# EAGLE design control_board-M0_breakout (EAGLE 8.3.1)
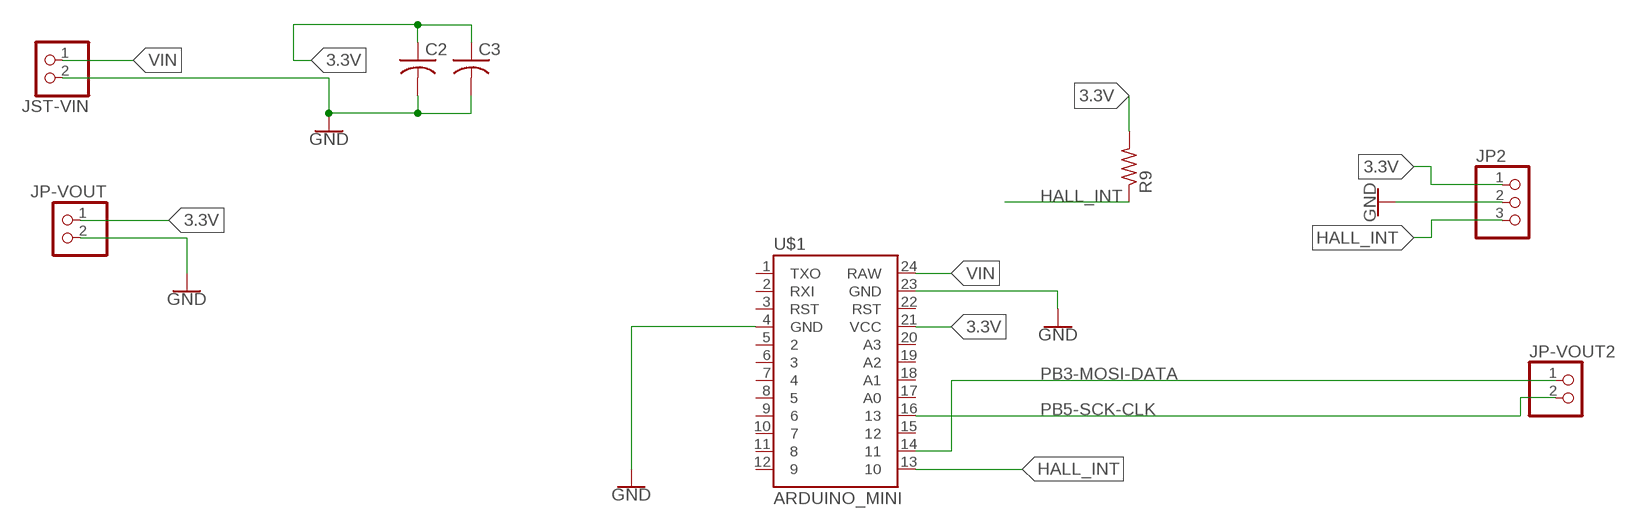
[diagram p0: schematic, sheet 1]

## Parts
C2  C-US025-060X050  [C025-060X050]
C3  C-US025-060X050  [C025-060X050]
JP2  PINHD-1X3  [1X03]
JP-VOUT  PINHD-1X2  [1X02]
JP-VOUT2  PINHD-1X2  [1X02]
JST-VIN  JST_2PIN-THM-RA  [JST-PH-2-THM-RA]
R9  R-US_0207/7  [0207/7]
U$1  ARDUINO_MINI  [ARDUINO_MINI]

## Nets
3.3V: C2.1 C3.1 JP2.1 JP-VOUT.1 R9.2 U$1.21(VCC)
GND: C2.2 C3.2 JP2.2 JP-VOUT.2 JST-VIN.2 U$1.4(GND) U$1.23(GND)
HALL_INT: JP2.3 R9.1 U$1.13
PB3-MOSI-DATA: JP-VOUT2.1 U$1.14
PB5-SCK-CLK: JP-VOUT2.2 U$1.16
VIN: JST-VIN.1 U$1.24(RAW)
Unconnected: U$1.1(TXO) U$1.2(RXI) U$1.3(RST) U$1.5 U$1.6 U$1.7 U$1.8 U$1.9 U$1.10 U$1.11 U$1.12 U$1.15 U$1.17(A0) U$1.18(A1) U$1.19(A2) U$1.20(A3) U$1.22(RST)

## Library data of the parts
C2 C3 = adafruit:C-US: CAPACITOR, American symbol
JP2 = pinhead:PINHD-1X3: PIN HEADER
JP-VOUT JP-VOUT2 = pinhead:PINHD-1X2: PIN HEADER
JST-VIN = adafruit:JST_2PIN: JST 2-Pin Connectors of various flavors SMT-RA (S2B-PH-SM4) 4UConnector #17311 SMT (B2B-PH-SM4) THM-RA (S2B-PH) THM (B2B-PH)
R9 = adafruit:R-US_: RESISTOR, American symbol
U$1 = SparkFun-Retired:ARDUINO_MINI: Arduino Pro Mini footprint

## Board
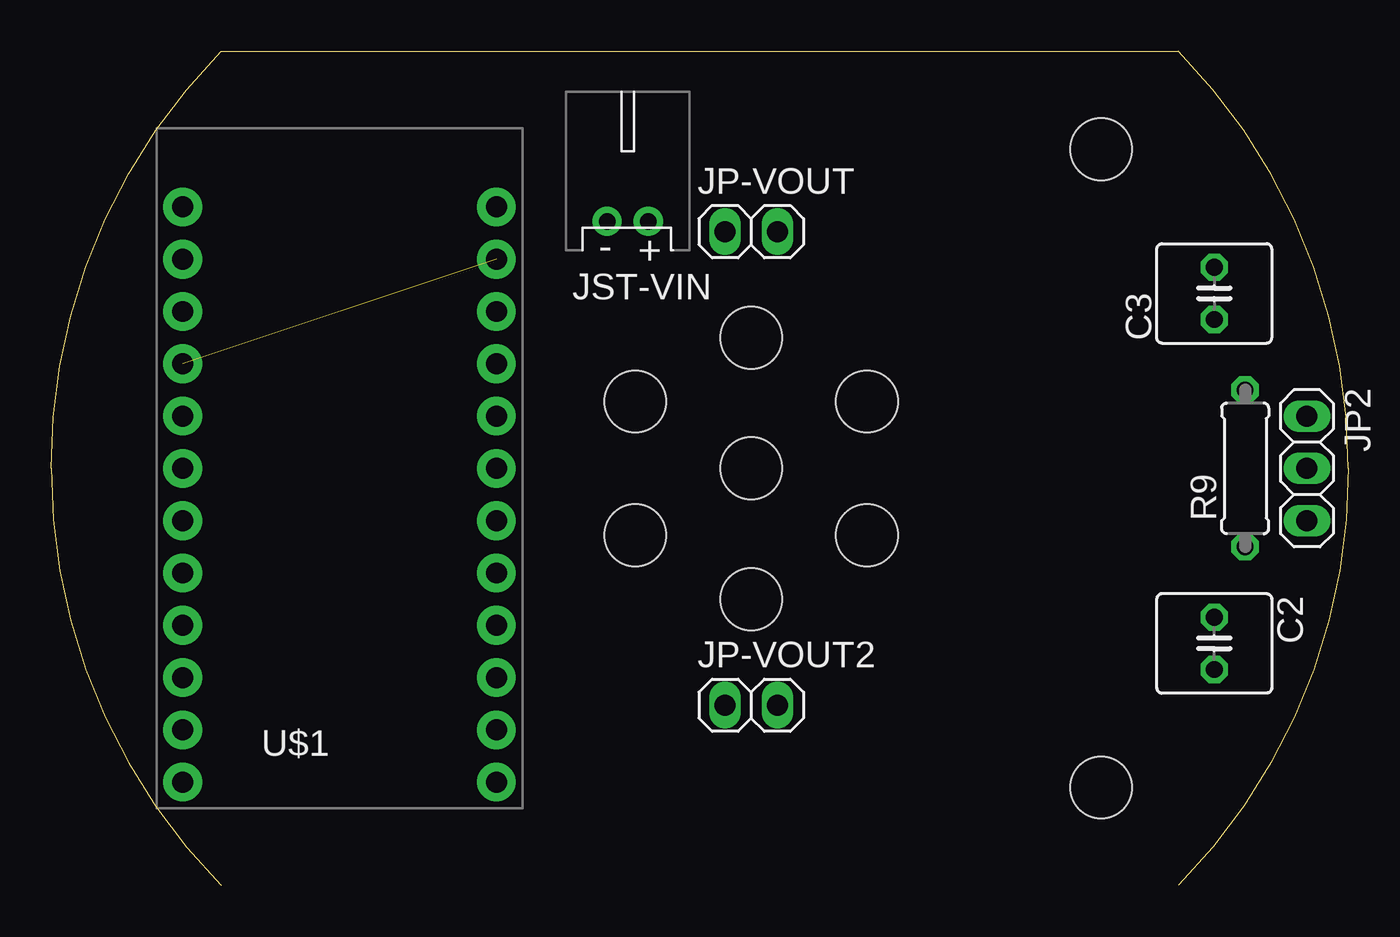
[diagram p1: board, top side]
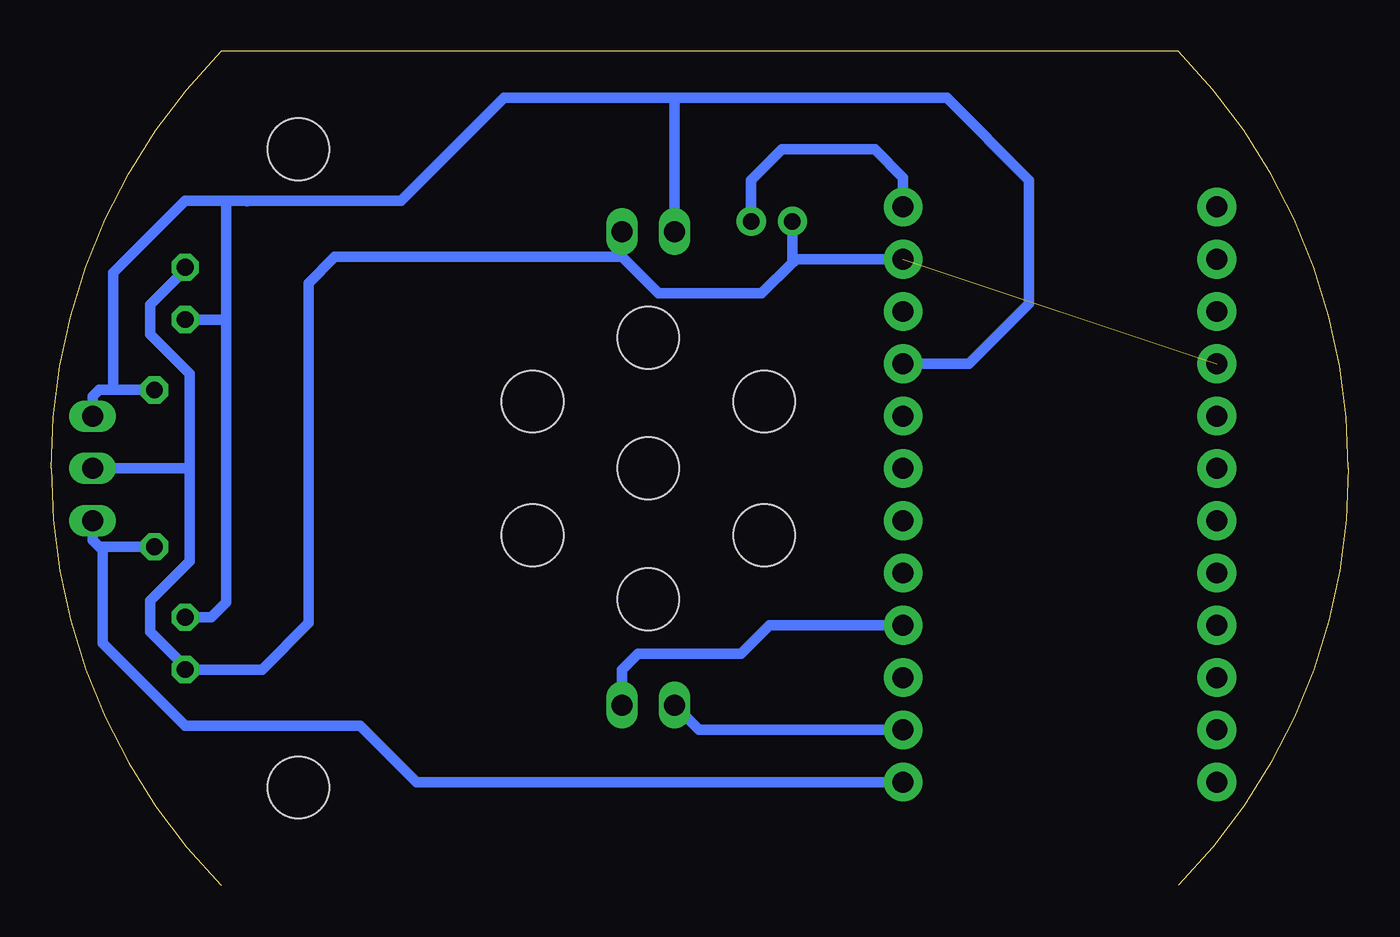
[diagram p2: board, bottom side, seen from below]

Size 63 x 40.5 mm. Coordinates in mm from the lower left corner, seen from the top.
Outline: 8.25,0 arc-45 0,20.25 arc-45 8.25,40.5 54.75,40.5 arc-45 63,20.25 arc-45 54.75,0
Copper layers (1*16): Top 0.035mm / dielectric 1.5mm / Bottom 0.035mm
Design rules "OthermillDRC_1_32_v2": minimum track width 8mil, minimum drill 0.8mm, track to track 0.794003125mm, track to pad 0.794003125mm, pad to pad 0.794003125mm, via to via 0.794003125mm, smd to smd 0mil, copper to edge 0mil, drill to drill 1mil, minimum pad ring 10mil, minimum via ring 10mil, stop-mask expansion 1mil, vias tented up to drill 30mil, thermal gap 10mil
Holes 3 mm at 34,20.25 34,26.6 39.63,17 28.37,17 51,35.75 51,4.75 34,20.25 34,13.9 28.37,23.5 39.63,23.5

### Footprints (pad centres in the part's own frame; a part is rotated, then mirrored left to right if it is on the bottom)
C025-060X050 = drill 0.813 octagon: 1 -1.27,0; 2 1.27,0
1X03 = drill 1.016 long: 1 -2.54,0; 2 0,0; 3 2.54,0
1X02 = drill 1.016 long: 1 -1.27,0; 2 1.27,0
JST-PH-2-THM-RA = drill 0.8 pad 1.422: 1 1,0; 2 -1,0
0207/7 = drill 0.813 octagon: 1 -3.81,0; 2 3.81,0
ARDUINO_MINI = drill 1.016 pad 1.88: 1 -7.62,12.7; 2 -7.62,10.16; 3 -7.62,7.62; 4 -7.62,5.08; 5 -7.62,2.54; 6 -7.62,0; 7 -7.62,-2.54; 8 -7.62,-5.08; 9 -7.62,-7.62; 10 -7.62,-10.16; 11 -7.62,-12.7; 12 -7.62,-15.24; 13 7.62,-15.24; 14 7.62,-12.7; 15 7.62,-10.16; 16 7.62,-7.62; 17 7.62,-5.08; 18 7.62,-2.54; 19 7.62,0; 20 7.62,2.54; 21 7.62,5.08; 22 7.62,7.62; 23 7.62,10.16; 24 7.62,12.7

### Placement (x,y rotation side)
C2  56.5,11.75 270 top
C3  56.5,28.75 90 top
JP2  61,20.25 270 top
JP-VOUT  34,31.75 0 top
JP-VOUT2  34,8.75 0 top
JST-VIN  28,32.25 0 top
R9  58,20.25 90 top
U$1  14,20.25 0 top

### Tracks (layer width: path | path; a pad name or v marks a point on that pad's centre or on a via)
3.3V
  Bottom 0.508: 60.05,24.06 60.69,24.06 61,23.75 JP2.1 | R9.2 60.05,24.06 | 54.56,33.25 53.46,33.25 | 54.56,33.25 56.5,33.25 60,29.75 60,24.11 60.05,24.06 | 53.48,33.23 53.46,33.25 | 53.46,33.25 46,33.25 41,38.25 32.72,38.25 | 32.72,38.25 19.5,38.25 15.5,34.25 15.5,28.25 18.42,25.33 U$1.21 | JP-VOUT.1 32.73,38.24 32.72,38.25 | C2.1 55.23,13.02 54.5,13.75 54.5,27.3 | 54.5,27.3 54.5,33.19 54.56,33.25 | 54.5,27.3 54.68,27.48 C3.1
GND  (1 unrouted)
  Bottom 0.508: JP-VOUT.2 35.27,30.52 | 27,30.25 28.5,28.75 33.5,28.75 35.27,30.52 | 27,30.25 JST-VIN.2 | U$1.23 26.84,30.41 27,30.25 | C3.2 56.5,29.9 58.21,28.19 58.21,26.77 56.29,24.86 56.29,20.22 | 56.29,20.22 56.29,15.73 58.21,13.82 58.21,12.31 56.5,10.6 C2.2 52.77,10.48 50.5,12.75 50.5,29.25 49.23,30.52 35.27,30.52 | JP2.2 56.33,20.25 56.29,20.22
HALL_INT
  Bottom 0.508: 60.41,16.44 R9.1 | 60.41,16.44 60.69,16.44 61,16.75 JP2.3 | U$1.13 45.26,5.01 48,7.75 56.5,7.75 60.5,11.75 60.5,16.35 60.41,16.44
PB3-MOSI-DATA
  Bottom 0.508: U$1.14 31.53,7.55 JP-VOUT2.1
PB5-SCK-CLK
  Bottom 0.508: JP-VOUT2.2 35.27,10.48 34.5,11.25 29.5,11.25 28.12,12.63 U$1.16
VIN
  Bottom 0.508: U$1.24 21.62,34.37 23,35.75 27.5,35.75 29,34.25 JST-VIN.1